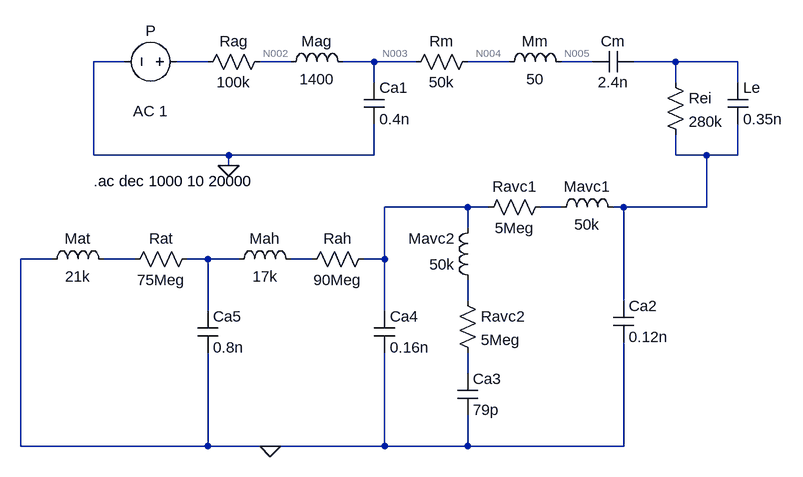
[diagram p0: schematic mic_pres_dinamico.asc]
mic_pres_dinamico.asc, the LTspice schematic file:
Version 4
SHEET 1 1172 708
WIRE -32 96 -80 96
WIRE 96 96 48 96
WIRE 224 96 176 96
WIRE 352 96 304 96
WIRE 416 96 352 96
WIRE 560 96 496 96
WIRE 688 96 640 96
WIRE 816 96 752 96
WIRE 912 96 816 96
WIRE 352 128 352 96
WIRE 816 128 816 96
WIRE 912 128 912 96
WIRE -80 240 -80 96
WIRE 128 240 -80 240
WIRE 352 240 352 192
WIRE 352 240 128 240
WIRE 816 240 816 208
WIRE 864 240 816 240
WIRE 912 240 912 192
WIRE 912 240 864 240
WIRE 128 256 128 240
WIRE 496 320 368 320
WIRE 528 320 496 320
WIRE 640 320 608 320
WIRE 736 320 720 320
WIRE 864 320 864 240
WIRE 864 320 736 320
WIRE 496 352 496 320
WIRE -144 400 -192 400
WIRE -16 400 -64 400
WIRE 96 400 64 400
WIRE 144 400 96 400
WIRE 256 400 224 400
WIRE 368 400 368 320
WIRE 368 400 336 400
WIRE 496 464 496 432
WIRE 736 464 736 320
WIRE 96 480 96 400
WIRE 368 480 368 400
WIRE 496 576 496 544
WIRE -192 688 -192 400
WIRE 96 688 96 544
WIRE 96 688 -192 688
WIRE 192 688 96 688
WIRE 368 688 368 544
WIRE 368 688 192 688
WIRE 496 688 496 640
WIRE 496 688 368 688
WIRE 736 688 736 528
WIRE 736 688 496 688
FLAG 128 256 0
FLAG 192 688 0
SYMBOL voltage 64 96 R90
WINDOW 0 -32 56 VBottom 2
WINDOW 3 32 56 VTop 2
WINDOW 123 60 56 VTop 2
WINDOW 39 0 0 Left 0
SYMATTR InstName P
SYMATTR Value ""
SYMATTR Value2 AC 1
SYMBOL res 192 80 R90
WINDOW 0 0 56 VBottom 2
WINDOW 3 32 56 VTop 2
SYMATTR InstName Rag
SYMATTR Value 100k
SYMBOL ind 208 112 R270
WINDOW 0 32 56 VTop 2
WINDOW 3 5 56 VBottom 2
SYMATTR InstName Mag
SYMATTR Value 1400
SYMBOL cap 336 128 R0
SYMATTR InstName Ca1
SYMATTR Value 0.4n
SYMBOL res 512 80 R90
WINDOW 0 0 56 VBottom 2
WINDOW 3 32 56 VTop 2
SYMATTR InstName Rm
SYMATTR Value 50k
SYMBOL cap 752 80 R90
WINDOW 0 0 32 VBottom 2
WINDOW 3 32 32 VTop 2
SYMATTR InstName Cm
SYMATTR Value 2.4n
SYMBOL ind 544 112 R270
WINDOW 0 32 56 VTop 2
WINDOW 3 5 56 VBottom 2
SYMATTR InstName Mm
SYMATTR Value 50
SYMBOL res 800 112 R0
SYMATTR InstName Rei
SYMATTR Value 280k
SYMBOL cap 896 128 R0
SYMATTR InstName Le
SYMATTR Value 0.35n
SYMBOL cap 720 464 R0
SYMATTR InstName Ca2
SYMATTR Value 0.12n
SYMBOL ind 624 336 R270
WINDOW 0 32 56 VTop 2
WINDOW 3 5 56 VBottom 2
SYMATTR InstName Mavc1
SYMATTR Value 50k
SYMBOL res 624 304 R90
WINDOW 0 0 56 VBottom 2
WINDOW 3 32 56 VTop 2
SYMATTR InstName Ravc1
SYMATTR Value 5Meg
SYMBOL ind 512 448 R180
WINDOW 0 36 80 Left 2
WINDOW 3 36 40 Left 2
SYMATTR InstName Mavc2
SYMATTR Value 50k
SYMBOL res 480 448 R0
SYMATTR InstName Ravc2
SYMATTR Value 5Meg
SYMBOL cap 480 576 R0
SYMATTR InstName Ca3
SYMATTR Value 79p
SYMBOL cap 352 480 R0
SYMATTR InstName Ca4
SYMATTR Value 0.16n
SYMBOL res 352 384 R90
WINDOW 0 0 56 VBottom 2
WINDOW 3 32 56 VTop 2
SYMATTR InstName Rah
SYMATTR Value 90Meg
SYMBOL ind 128 416 R270
WINDOW 0 32 56 VTop 2
WINDOW 3 5 56 VBottom 2
SYMATTR InstName Mah
SYMATTR Value 17k
SYMBOL cap 80 480 R0
SYMATTR InstName Ca5
SYMATTR Value 0.8n
SYMBOL res -32 416 R270
WINDOW 0 32 56 VTop 2
WINDOW 3 0 56 VBottom 2
SYMATTR InstName Rat
SYMATTR Value 75Meg
SYMBOL ind -160 416 R270
WINDOW 0 32 56 VTop 2
WINDOW 3 5 56 VBottom 2
SYMATTR InstName Mat
SYMATTR Value 21k
TEXT -80 280 Left 2 !.ac dec 1000 10 20000

The netlist it stands for:
* mic_pres_dinamico.asc
V§P N001 0 AC 1
Rag N002 N001 100k
L§Mag N002 N003 1400
Ca1 N003 0 0.4n
Rm N004 N003 50k
Cm N006 N005 2.4n
L§Mm N004 N005 50
Rei N006 N007 280k
C§Le N006 N007 0.35n
Ca2 N007 0 0.12n
L§Mavc1 N009 N007 50k
Ravc1 N009 N008 5Meg
L§Mavc2 N013 N008 50k
Ravc2 N013 N014 5Meg
Ca3 N014 0 79p
Ca4 N008 0 0.16n
Rah N008 N012 90Meg
L§Mah N011 N012 17k
Ca5 N011 0 0.8n
Rat N010 N011 75Meg
L§Mat 0 N010 21k
.ac dec 1000 10 20000
.backanno
.end

* Results of the author's LTspice run, read from the files saved beside the schematic
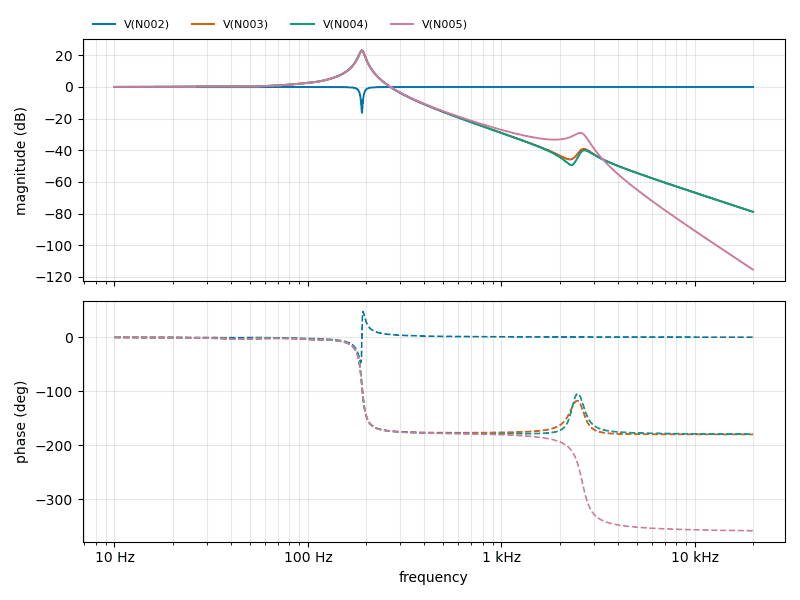
[diagram p1: AC Analysis of mic_pres_dinamico.asc, plotted from the saved traces]
* AC Analysis, 1 run:
*   V(N002): -0.01 dB at 10 Hz, -0.00 dB at 20 kHz, peak -0.00 dB at 20 kHz, 3 dB below the peak at 196.6 Hz
*   V(N003): 0.03 dB at 10 Hz, -78.90 dB at 20 kHz, peak 23.04 dB at 190.1 Hz, 3 dB below the peak at 183.3 Hz and 196.3 Hz
*   V(N004): 0.02 dB at 10 Hz, -78.90 dB at 20 kHz, peak 23.03 dB at 190.1 Hz, 3 dB below the peak at 183.3 Hz and 196.3 Hz
*   V(N005): 0.02 dB at 10 Hz, -115.44 dB at 20 kHz, peak 23.10 dB at 190.1 Hz, 3 dB below the peak at 183.3 Hz and 196.4 Hz